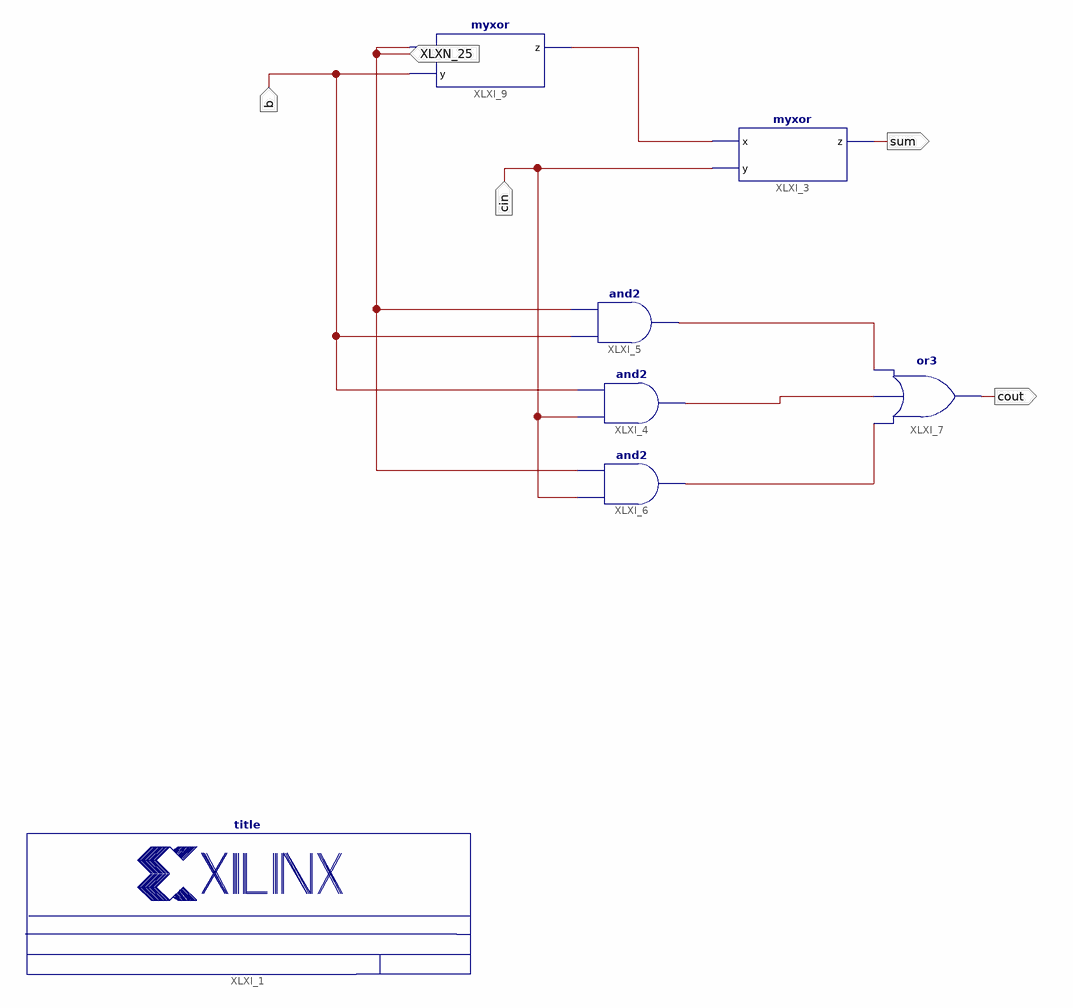
[diagram p0: schematic sheet 1]
// Xilinx ISE schematic fuller_adder_sch.sch (spartan3e) as structural Verilog: 7 symbols, 5 ports
module fuller_adder_sch (
  input  b,
  input  cin,
  input  XLXN_25,
  output sum,
  output cout
);

  wire XLXN_12, XLXN_13, XLXN_14, XLXN_23;

  title #(.NameFieldText("Full adder")) XLXI_1 ();
  myxor XLXI_3 (.x(XLXN_23), .y(cin), .z(sum));
  and XLXI_4 (XLXN_12, cin, b);
  and XLXI_5 (XLXN_14, b, XLXN_25);
  and XLXI_6 (XLXN_13, cin, XLXN_25);
  or XLXI_7 (cout, XLXN_13, XLXN_12, XLXN_14);
  myxor XLXI_9 (.x(XLXN_25), .y(b), .z(XLXN_23));
endmodule
